# Altium project Single motor monitoring Beta.PrjPcb
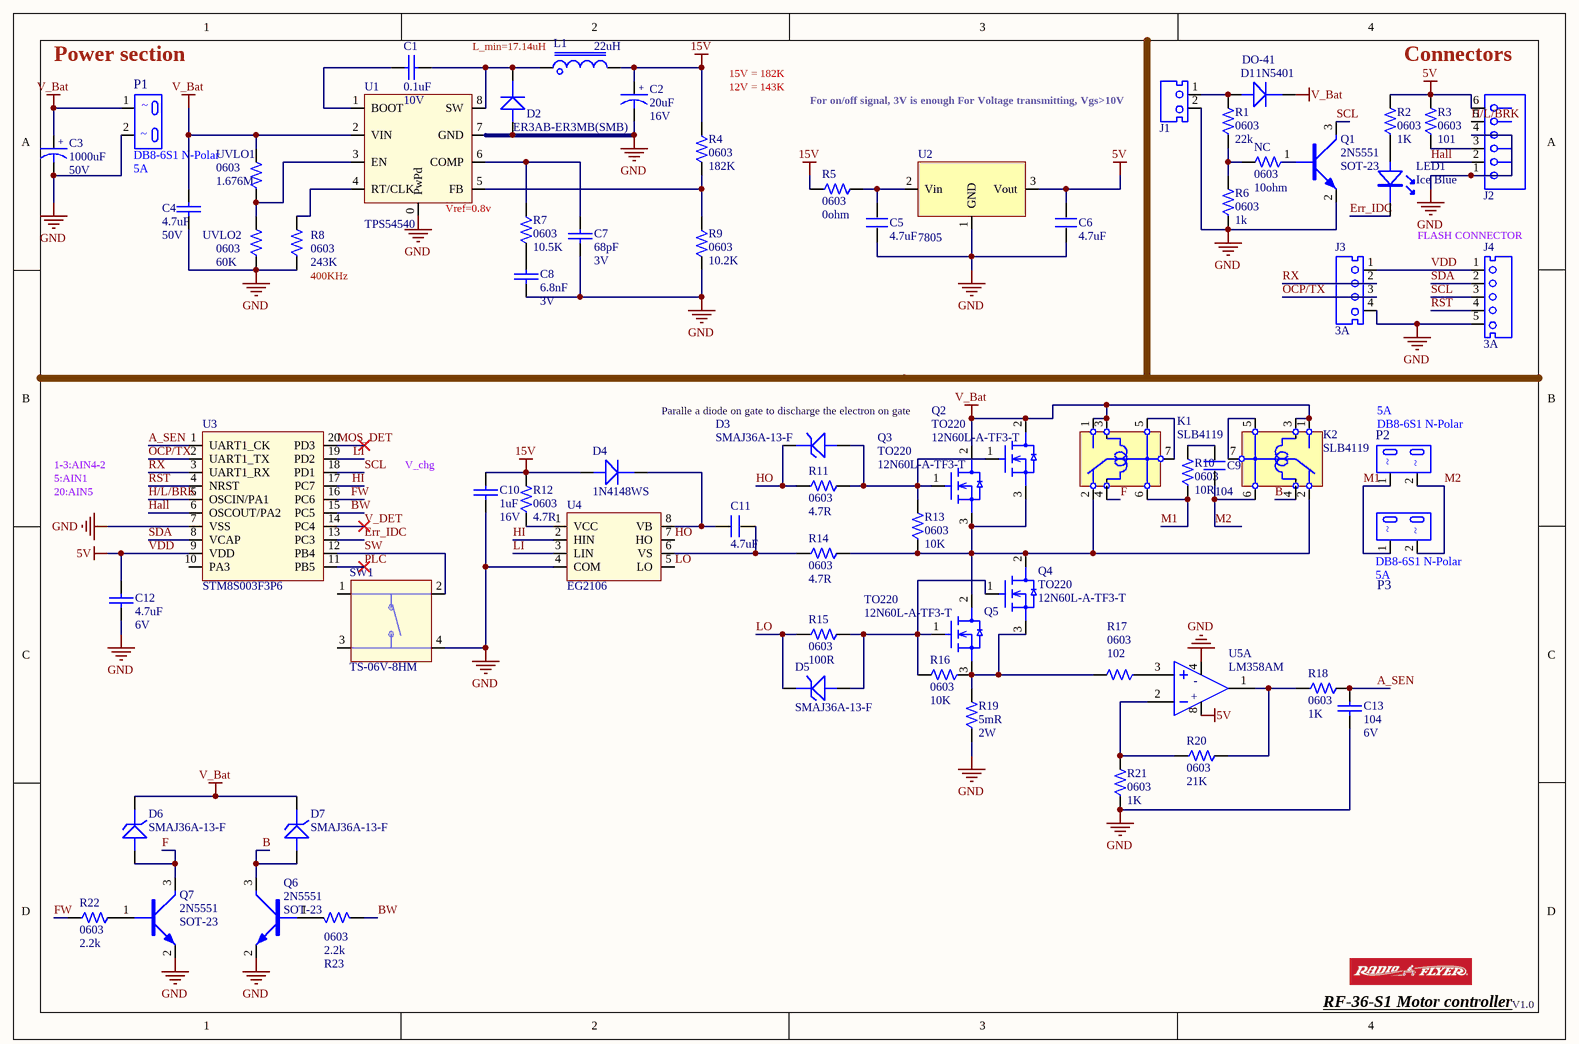
[diagram p0: Single motor monitoring Beta.SchDoc]
1 sheet, 70 parts. Net scope: global (net labels, ports and power ports of the same name join across sheets).
Board files: RF-36-S1 V1.0.PcbDoc, RF-36-S1 V2.PcbDoc, RF36V Beta.PcbDoc

## Sheet Single motor monitoring Beta.SchDoc
size A4

### Parts
C1  value 0.1uF  Voltage: 10V  [CAPC0603-RW]  (hidden comment: PXL456470-1530)
C2  value 20uF  Voltage: 16V  [CASE - D]  (hidden comment: PBE099540-1010)
C3  value 1000uF  Voltage: 50V  [CAP_Radial_D13L25P5.0]  (hidden comment: PVE599570-4710)
C4  value 4.7uF  Voltage: 50V  [CAPC0603-RW]  (hidden comment: PXL456470-1530)
C5  4.7uF  [0603-RW]
C6  4.7uF  [0603-RW]
C7  value 68pF  Voltage: 3V  [CAPC0603-RW]  (hidden comment: PXL456470-1530)
C8  value 6.8nF  Voltage: 3V  [CAPC0603-RW]  (hidden comment: PXL456470-1530)
C9  104  [0603]
C10  value 1uF  Voltage: 16V  [CAPC0603-RW]  (hidden comment: PXL456470-1530)
C11  4.7uF  [0603-RW]
C12  value 4.7uF  Voltage: 6V  [CAPC0603-RW]  (hidden comment: PXL456470-1530)
C13  value 104  Voltage: 6V  [CAPC0603-RW]  (hidden comment: PXL456470-1530)
D1  MFG Part: 1N5401  Package: DO-41  [DO-41-V-P5.08]  (hidden comment: RAD114004-0010)
D2  MFG Part: ER3AB-ER3MB(SMB)  [SMB]  (hidden comment: T571002930249)
D3  SMAJ36A-13-F  [SMA]
D4  RCD114148-0020  [SOD-323]  (value not drawn)
D5  SMAJ36A-13-F  [SMA]
D6  SMAJ36A-13-F  [SMA]
D7  SMAJ36A-13-F  [SMA]
J1  T690300125300  [CONN 2P PH=2.5mm HAA250A-2 WHITE]  (value not drawn)
J2  T690300121600  [CONN 6P PH=2.5mm RA XHB-6AW-KL]  (value not drawn)
J3  Current: 3A  [CONN 4P PH=2.5mm B4B-XH-A]  (hidden comment: CCN250000-0104)
J4  Current: 3A  [CONN 5P PH=2.5mm B5B-XH-A]  (hidden comment: CCN250000-0105)
K1  SLB4119  [RELAY SLB4119]
K2  SLB4119  [RELAY SLB4119]
L1  value 22uH  [IND CSAB0740]  (hidden comment: T621000090500)
LED1  Color: Ice Blue  [LED0805-Blue]  (hidden comment: T575011290263)
NC  value 10ohm  Package: 0603  [0603-RW]  (hidden comment: T501348102129)
P1  MFG Part: DB8-6S1 N-Polar  Current: 5A  [Bat connector]  (hidden comment: CJP012009-0050)
P2  MFG Part: DB8-6S1 N-Polar  Current: 5A  [Motor connector]  (hidden comment: CJP012009-0050)
P3  MFG Part: DB8-6S1 N-Polar  Current: 5A  [Motor connector]  (hidden comment: CJP012009-0050)
Q1  MFG Part: 2N5551  Package: SOT-23  [SOT23-132-RW]  (hidden comment: RCN000846-0001)
Q2  Package: TO220  [TO220-F]  (hidden comment: RHM120060-1001)
Q3  Package: TO220  [TO220-F]  (hidden comment: RHM120060-1001)
Q4  Package: TO220  [TO220-F]  (hidden comment: RHM120060-1001)
Q5  Package: TO220  [TO220-F]  (hidden comment: RHM120060-1001)
Q6  MFG Part: 2N5551  Package: SOT-23  [SOT23-132-RW]  (hidden comment: RCN000846-0001)
Q7  MFG Part: 2N5551  Package: SOT-23  [SOT23-132-RW]  (hidden comment: RCN000846-0001)
R1  value 22k  Package: 0603  [0603-RW]  (hidden comment: T501348102129)
R2  value 1K  Package: 0603  [0603-RW]  (hidden comment: T501348102129)
R3  value 101  Package: 0603  [0603-RW]  (hidden comment: T501348102129)
R4  value 182K  Package: 0603  [0603-RW]  (hidden comment: T501348102129)
R5  value 0ohm  Package: 0603  [0603-RW]  (hidden comment: T501348102129)
R6  value 1k  Package: 0603  [0603-RW]  (hidden comment: T501348102129)
R7  value 10.5K  Package: 0603  [0603-RW]  (hidden comment: T501348102129)
R8  value 243K  Package: 0603  [0603-RW]  (hidden comment: T501348102129)
R9  value 10.2K  Package: 0603  [0603-RW]  (hidden comment: T501348102129)
R10  value 10R  Package: 0603  [0603-RW]  (hidden comment: T501348102129)
R11  value 4.7R  Package: 0603  [0603-RW]  (hidden comment: T501348102129)
R12  value 4.7R  Package: 0603  [0603-RW]  (hidden comment: T501348102129)
R13  value 10K  Package: 0603  [0603-RW]  (hidden comment: T501348102129)
R14  value 4.7R  Package: 0603  [0603-RW]  (hidden comment: T501348102129)
R15  value 100R  Package: 0603  [0603-RW]  (hidden comment: T501348102129)
R16  value 10K  Package: 0603  [0603-RW]  (hidden comment: T501348102129)
R17  value 102  Package: 0603  [0603-RW]  (hidden comment: T501348102129)
R18  value 1K  Package: 0603  [0603-RW]  (hidden comment: T501348102129)
R19  value 5mR  Power: 2W  [5W-22X10-H]  (hidden comment: QHE505000-5190)
R20  value 21K  Package: 0603  [0603-RW]  (hidden comment: T501348102129)
R21  value 1K  Package: 0603  [0603-RW]  (hidden comment: T501348102129)
R22  value 2.2k  Package: 0603  [0603-RW]  (hidden comment: T501348102129)
R23  value 2.2k  Package: 0603  [0603-RW]  (hidden comment: T501348102129)
SW1  MFG Part: TS-06V-8HM  [TS_6X6X8_DIP]  (hidden comment: MSWA06012-0010)
U1  TPS54540  [SO8-EP]
U2  7805  [SOT89]
U3  MFG Part: STM8S003F3P6  [TSSOP20]  (hidden comment: RCI800336-0001)
U4  MFG Part: EG2106  [SO8]  (hidden comment: T610900027257)
U5  RCI000358-0001  [SO8]  (value not drawn)  (part A of 2)
UVLO1  value 1.676M  Package: 0603  [0603-RW]  (hidden comment: T501348102129)
UVLO2  value 60K  Package: 0603  [0603-RW]  (hidden comment: T501348102129)

### Nets
15V: C2.1 C10.1 D4.1(A) L1.2 R4.1 R5.1 R12.2
GND: C2.2 C3.2 C4.2 C5.1 C6.1 C7.2 C8.2 C10.2 C12.2 C13.2 D2.1(A) J1.2 J2.1 J2.4 J3.4 J4.5 P1.2 Q1.2(E) Q6.2(E) Q7.2(E) R6.1 R8.1 R9.2 R19.1 R21.1 SW1.4 U1.0(PwPd) U1.7(GND) U2.1(GND) U3.7(VSS) U4.4(COM) U5.4 UVLO2.1
V_Bat: C3.1 C4.1 D1.2(K) D6.2(K) D7.2(K) K1.1 K1.3 K2.1 K2.3 P1.1 Q2.2(D) Q3.2(D) U1.2(VIN) UVLO1.2
VDD: C6.2 C12.1 J2.6 J3.1 J4.1 R2.2 R3.2 U2.3(Vout) U3.9(VDD) U5.8  [also labelled 5V]
A_SEN: C13.1 R18.2 U3.1(UART1_CK)
B: D7.1(A) K2.4 Q6.3(C)
BW: R23.1 U3.15(PC5)
Err_IDC: LED1.2(K) U3.13(PC3)
F: D6.1(A) K1.4 Q7.3(C)
FW: R22.1 U3.16(PC6)
H/L/BRK: J2.5 U3.5(OSCIN/PA1)
Hall: J2.2 U3.6(OSCOUT/PA2)
HI: U3.17(PC7) U4.2(HIN)
HO: D3.2(K) R11.1 U4.7(HO)
LI: U3.19(PD2) U4.3(LIN)
LO: D5.2(K) R15.1 U4.5(LO)
M1: K1.6 P2.1 P3.1 R10.1
M2: C9.1 K2.6 P2.2 P3.2
MOS_DET: U3.20(PD3)
OCP/TX: J3.3 U3.2(UART1_TX)
PLC: U3.11(PB5)
RST: J4.4 U3.4(NRST)
RX: J3.2 U3.3(UART1_RX)
SCL: J4.3 Q1.3(C) U3.18(PD1)
SDA: J4.2 U3.8(VCAP)
SW: SW1.2 U3.12(PB4)
V_DET: U3.14(PC4)
NetC1_1: C1.1 U1.1(BOOT)
NetC1_2: C1.2 D2.2(K) L1.1 U1.8(SW)
NetC5_2: C5.2 R5.2 U2.2(Vin)
NetC7_1: C7.1 R7.1 U1.6(COMP)
NetC8_1: C8.1 R7.2
NetC9_2: C9.2 R10.2
NetC11_1: C11.1 R14.1 U4.6(VS)
NetC11_2: C11.2 D4.2(K) U4.8(VB)
NetD1_1: D1.1(A) J1.1 R1.2
NetD3_1: D3.1(A) Q2.1(G) Q3.1(G) R11.2 R13.2
NetD5_1: D5.1(A) Q4.1(G) Q5.1(G) R15.2 R16.2
NetJ2_3: J2.3 R3.1
NetK1_2: K1.2 K2.2 Q2.3(S) Q3.3(S) Q4.2(D) Q5.2(D) R13.1 R14.2
NetK1_5: K1.5 K1.7
NetK2_5: K2.5 K2.7
NetLED1_1: LED1.1(A) R2.1
NetNC_1: NC.1 Q1.1(B)
NetNC_2: NC.2 R1.1 R6.2
NetQ4_3: Q4.3(S) Q5.3(S) R16.1 R17.2 R19.2
NetQ6_1: Q6.1(B) R23.2
NetQ7_1: Q7.1(B) R22.2
NetR4_2: R4.2 R9.1 U1.5(FB)
NetR8_2: R8.2 U1.4(RT/CLK)
NetR12_1: R12.1 U4.1(VCC)
NetR17_1: R17.1 U5.3(IN+)
NetR18_1: R18.1 R20.2 U5.1(OUT)
NetR20_1: R20.1 R21.2 U5.2(IN-)
NetU1_3: U1.3(EN) UVLO1.1 UVLO2.2

Not connected (* = marked no-connect by the designer): SW1 1 3; U3 10(PA3)

### Notes on the sheet
- L_min=17.14uH
- (near P1) Power section
- 15V = 182K
- (near R4) 12V = 143K
- (near J1) For on/off signal, 3V is enough For Voltage transmitting, Vgs>10V
- Connectors
- (near U1) Vref=0.8v
- FLASH CONNECTOR
- (near R8) 400KHz
- Paralle a diode on gate to discharge the electron on gate
- 1-3:AIN4-2
- 5:AIN1
- 20:AIN5
- V_chg
- RF-36-S1 Motor controller
- V1.0
- (in symbol AC INLET 2P DB8-6S1 N-Polar) ~
- (in symbol CAP E 100uF 16V 20% SMD) +
- (in symbol CAP E Aluminum 470uF 50V 20% - PVE599570-4710) +
- (in symbol LM358AM, part A) -; +

### Library data of the parts
C1 C4 C7 C8 C10 C12 C13 = CAP0603 0.015uF 50V 10%: GP CHIP CAP 0.015uF 50V 10% 0603 TYPE X7R; SAP: T542021537508; Vendor Code: 10010262; Vendor Name: 东莞市晴远电子有限公司; Type: Capacitor; DIP&SMD: SMD; PACKAGE: CAPC0603; MFG: *; MFG Part: *; Other: X7R; Tolerance: 10%; Customer Specific: N/A
C2 = CAP E 100uF 16V 20% SMD: CHIP ELECT 100uF 16V 20% SMD 6.3x5.4mm; SAP: T551101434030; Vendor Name: 深圳市春明电子有限公司; Vendor Code: 10020343; Type: Capacitor; PACKAGE: CASE - D; MFG: *; MFG Part: *; Other: *; Tolerance: 20%; DIP&SMD: SMD; Customer Specific: N/A
C3 = CAP E Aluminum 470uF 50V 20% - PVE599570-4710: COND ELECT 470uF 50V 20% 105 13x25mm; SAP: T552471464020; Vendor Name: 惠州市佳维诚电子有限公司; Vendor Code: 10020154; MFG: 佳维诚; Type: Capacitor; DIP&SMD: DIP; PACKAGE: 470uF/50V; MFG Part: *; Other: *; Tolerance: 20%; Customer Specific: N/A
C5 C6 C9 C11 = C
D1 = 1N4004S: GP DIODE  1N4004 1A 280VRMS DO-41; MFG: PANJIT; SAP: T571002250423; Vendor Name: 深圳市春明电子有限公司; Vendor Code: 10020343; Voltage: 400V; DIP&SMD: DIP; Current: 1A; Type: DIODE; Customer Specific: N/A
D2 = DIO ER3DB: DIODE 200V 3A ER3DB M.C.C K; MFG: MCCSEMI; Voltage: 50V~1000V; DIP&SMD: SMD; CREATE_NAME: cherry; CREATE_TIME: 20190104; SAP: T571002930249; Vendor Name: *; Vendor Code: *; Current: 3A; Type: DIODE; Customer Specific: N/A; Package: SMB
D3 D5-D7 = SMAJ36A-13-F: MFG: DIODE; CREATE_NAME: Nathan; DIP&SMD: SMD; SAP: *; Vendor Name: *; Vendor Code: *; Voltage: *; Ippm: *; CREATE_TIME: 16-Oct-2020; Type: DIODE; Package: SMA; Customer Specific: N/A; MFG Part: SMAJ36A-13-F
D4 = 1N4148WS: DIODE SW 1N4148 VF=0.7V SOD-323; MFG: TW SEMICONDUCTOR; SAP: T572005070208; Voltage: 100V; Current: 150MA; DIP&SMD: SMD; Vendor Name: *; Vendor Code: *; Type: DIODE; Package: SOD-323; Customer Specific: N/A; MFG Part: 1N4148WS
J1 = CONN 2P PH=2.5mm HAA250A-2 BLACK: CONNECTOR HA2.5 2PIN BLACK K; Value: 2.5mm; MFG: 金瑞康; CREATE_NAME: Nathan; Current: 3A; DIP&SMD: DIP; SAP: T690300125300; MFG Part: HAA250A-2 BLACK; Vendor Name: *; Vendor Code: *; Type: Connector; CREATE_TIME: 24-Nov-2017
J2 = CONN PH 6P PH=2.5mm RA XHB-6AW-KL: CONNECTOR 6PIN P=2.5 WHITE 90 K; Value: 2.5mm; MFG: 金佳电子; CREATE_NAME: Nathan; DIP&SMD: DIP; SAP: T690300121600; MFG Part: XHB-6AW-KL; Vendor Name: *; Vendor Code: *; Type: Connector; Current: *; CREATE_TIME: 27-Sep-2017
J3 = CONN 4P PH=2.5mm B4B-XH-A: GP CONNECTOR B4B-XH-A 4 PIN; Value: 2.5mm; SAP: T690300029000; Vendor Name: 亿源电子有限公司; Vendor Code: 10009989; DIP&SMD: DIP; MFG: *; MFG Part: *; Type: Connector
J4 = CONN 5P PH=2.5mm B5B-XH-A: CONNECTOR B5B-XH-A 5 PIN; Value: 2.5mm; SAP: T690300029100; Vendor Name: 深圳市利民丰电子有限公司; Vendor Code: 10020373; DIP&SMD: DIP; MFG: *; MFG Part: *; Type: Connector
K1 K2 = Relay SLB4119 7P
L1 = IND 22uH CSAB0740-220M: 22UH 4A 100K SMD CODACA CSAB074 K; Type: INDUCTOR; CREATE_NAME: Nathan; DCR: 125 mohm (max.); Tolerance: 20%; SAP: T621000090500; MFG: CODACA; Vendor Code: *; Vendor Name: *; CREATE_TIME: 30-Aug-2019; Current: 4A; MFG Part: CSAB0740-220M; DIP&SMD: SMD; Customer Specific: N/A
LED1 = LED0805B-H-0805AW61B008-Z2: LED 750 2.0X1. H-0805AW61B0 HONGBRIG G; MFG: HONGBRIGHT (弘亮光電); CREATE_NAME: Nathan; DIP&SMD: SMD; MFG Part: H-0805AW61B008-Z2; SAP: T575011290263; Package: 0805; Vendor Code: *; Vendor Name: *; Type: LED; CREATE_TIME: 31-OCT-2016
NC R1-R18 R20-R23 UVLO1 UVLO2 = RES0603 1/16W 0.1% 3.48K OHM: CHIP 3.48K OHM 50PPM +-0.1% 0603 WALS L; MFG Part: WF06T3481BTL; TOL: 0.1%; MFG: WALSIN; Power: 1/16 W; CREATE_NAME: Tom; DIP&SMD: SMD; SAP: T501348102129; Vendor Code: *; Vendor Name: *; Type: Resistor; CREATE_TIME: 12-Apr-2016; Customer Specific: N/A
P1-P3 = AC INLET 2P DB8-6S1 N-Polar: AC SOCKET 2P D2.36 2.5A 250V VDE BLACK; SAP: T690300011500; MFG: 金明浩; Vendor Name: 深圳市金明浩电子科技有限公司; Vendor Code: 10010007; DIP&SMD: DIP; Value: *; Type: Connector
Q1 Q6 Q7 = LBC846BLT1G: NPN LRC BC846BLT1G SOT23; SAP: T581003640437; Vendor Code: 10009129; Vendor Name: WING HING ENTERPRISE CO; DIP&SMD: SMD; MFG: LRC; Power: *; Voltage: *; Type: NPN; Customer Specific: N/A
Q2-Q5 = 12N60L-A-TF3-T: MOSFET 3PIN 12N60L-A -TF3-T TO-220F; SAP: T586002570924; Vendor Code: 10020223; Vendor Name: 丰富利科技（深圳）有限公司; Voltage: 600V; MFG: UTC; Current: 12A; DIP&SMD: DIP; Power: *; Type: MOSFET; Customer Specific: N/A; MFG Part: 12N60L-A-TF3-T
R19 = RES 5W 5% 5.1 OHM W10D9.5L22H22 QHE-5190: CEMENT RESISTOR 5.1OHM 5W 5% AXIAL; SAP: T710600010200; MFG: Xingdacheng; Vendor Code: 10008495; Vendor Name: 深圳市兴达诚电子有限公司; DIP&SMD: DIP; Package: 5W; TOL: 5%; MFG Part: RES 5W 5% 5.1 OHM W10D9.5L22H22 QHE; Type: Resistor; Customer Specific: N/A
SW1 = TACT SW H8.0 DIP: TACT SWITC 4P L6*W6*H8mm; SAP: T670200001500; MFG: ShenZhen GanHad; Force: 250gf; DIP&SMD: DIP; Vendor Code: *; Vendor Name: *; Value: TACT; Voltage: *; Current: *; Type: Switch
U1 = TPS54540: 4.5-42V input 5A output
U3 = N76E003: IC MCU 20P TSSOP20; MFG: ST; SAP: T610300083725; CREATE_NAME: GordonL@Deftronics; DIP&SMD: SMD; Vendor Code: *; Vendor Name: *; Type: IC; CREATE_TIME: 23-Mar-2014; Customer Specific: N/A
U4 = 2ED2106S06F: DRIVER 2ED2106S06F DSO-8 INFINEO K; MFG: Infineon; CREATE_NAME: Nathan; DIP&SMD: SMD; Vendor Code: *; Vendor Name: *; SAP: T610900027257; Type: IC; CREATE_TIME: 14-Apr-2020; Customer Specific: N/A
U5 = LM358AM: IC OP-AMP Dual LM358 DUAL OP-AMP SOIC8; SAP: T610500008001; Vendor Code: 10020355; Vendor Name: SERIAL MICROELECTRONICS (HK) LIMITE; MFG: National SEMI; DIP&SMD: SMD; Type: IC AMP; Customer Specific: N/A; MFG Part: LM358AM